# Altium project fish on its own.PrjPcb
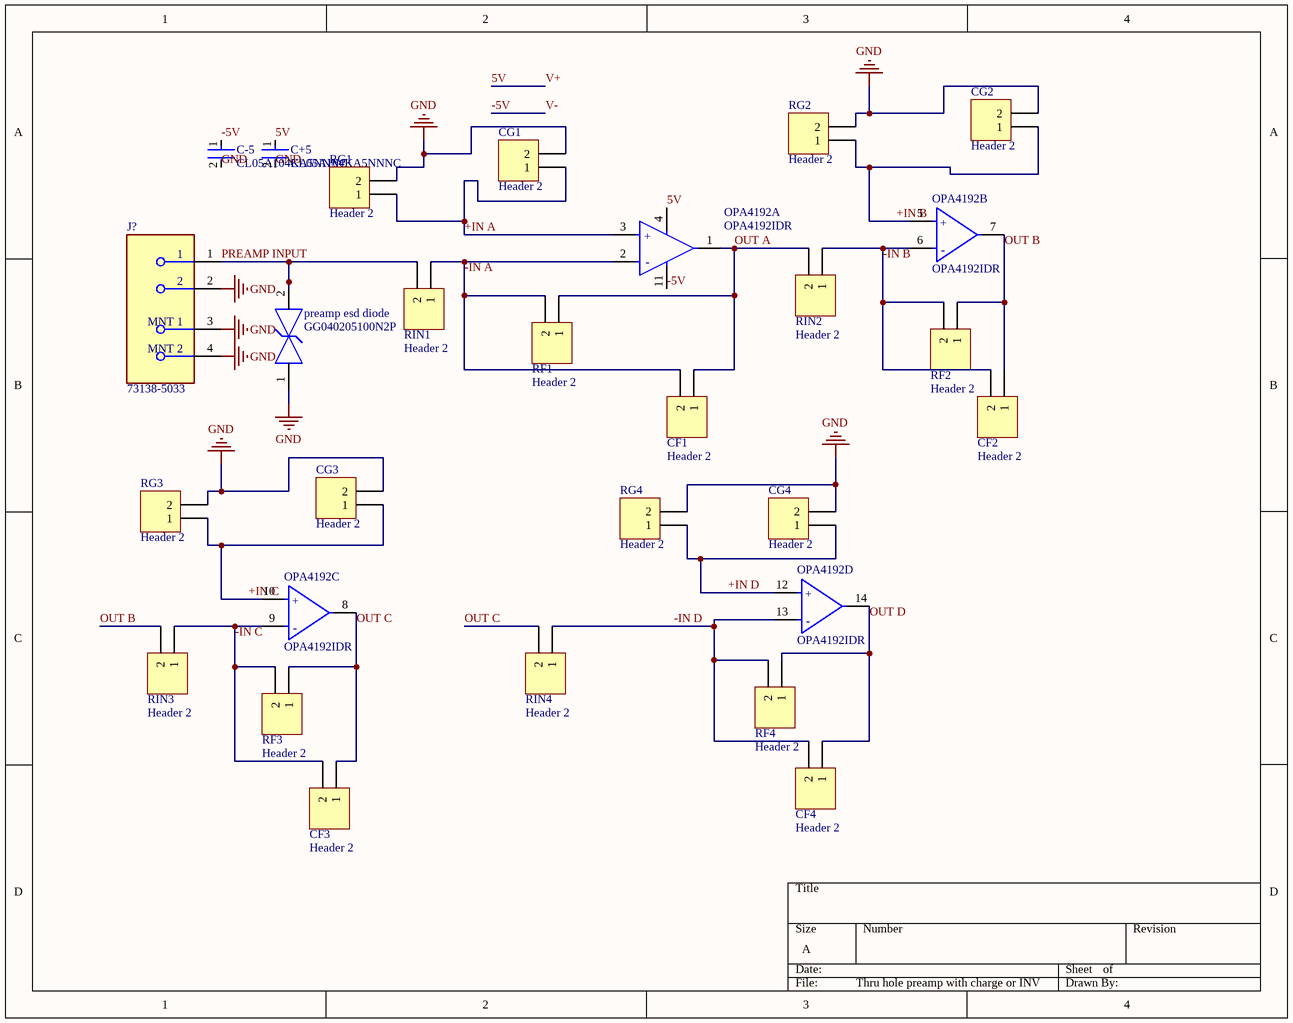
[diagram p0: Thru hole preamp with charge or INV stages with input resistors.SchDoc]
1 sheet, 25 parts. Net scope: global (net labels, ports and power ports of the same name join across sheets).
Board files: fish with thicker fin.PcbDoc, PCB1.PcbDoc

## Sheet Thru hole preamp with charge or INV stages with input resistors.SchDoc
size A; SheetNumber: 2; SheetTotal: 2

### Parts
C+5  CL05A104KA5NNNC  [FP-CL278-IPC_C]
C-5  CL05A104KA5NNNC  [FP-CL278-IPC_C]
CF1  Header 2  [HDR1X2]
CF2  Header 2  [HDR1X2]
CF3  Header 2  [HDR1X2]
CF4  Header 2  [HDR1X2]
CG1  Header 2  [HDR1X2]
CG2  Header 2  [HDR1X2]
CG3  Header 2  [HDR1X2]
CG4  Header 2  [HDR1X2]
J?  73138-5033  [FP-73138-5033-MFG]
OPA4192  OPA4192IDR  [FP-D0014A-IPC_C]  (parts A,B,C,D of 4)
preamp_esd_diode  GG040205100N2P  [FP-GG0402-MFG]
RF1  Header 2  [HDR1X2]
RF2  Header 2  [HDR1X2]
RF3  Header 2  [HDR1X2]
RF4  Header 2  [HDR1X2]
RG1  Header 2  [HDR1X2]
RG2  Header 2  [HDR1X2]
RG3  Header 2  [HDR1X2]
RG4  Header 2  [HDR1X2]
RIN1  Header 2  [HDR1X2]
RIN2  Header 2  [HDR1X2]
RIN3  Header 2  [HDR1X2]
RIN4  Header 2  [HDR1X2]

### Nets
GND: C+5.2 C-5.2 CG1.2 CG2.2 CG3.2 CG4.2 J?.2 J?.3(MNT_1) J?.4(MNT_2) preamp_esd_diode.1(IO_1) RG1.2 RG2.2 RG3.2 RG4.2
5V: C+5.1 OPA4192.4(V+)  [also labelled V+]
+IN A: CG1.1 OPA4192.3(+IN_A) RG1.1
+IN B: CG2.1 OPA4192.5(+IN_B) RG2.1
+IN C: CG3.1 OPA4192.10(+IN_C) RG3.1
+IN D: CG4.1 OPA4192.12(+IN_D) RG4.1
-5V: C-5.1 OPA4192.11(V-)  [also labelled V-]
-IN A: CF1.2 OPA4192.2(-IN_A) RF1.2 RIN1.1
-IN B: CF2.2 OPA4192.6(-IN_B) RF2.2 RIN2.1
-IN C: CF3.2 OPA4192.9(-IN_C) RF3.2 RIN3.1
-IN D: CF4.2 OPA4192.13(-IN_D) RF4.2 RIN4.1
OUT A: CF1.1 OPA4192.1(OUT_A) RF1.1 RIN2.2
OUT B: CF2.1 OPA4192.7(OUT_B) RF2.1 RIN3.2
OUT C: CF3.1 OPA4192.8(OUT_C) RF3.1 RIN4.2
OUT D: CF4.1 OPA4192.14(OUT_D) RF4.1
PREAMP INPUT: J?.1 preamp_esd_diode.2(IO_2) RIN1.2

### Notes on the sheet
- (in symbol CMP-04895-000275-1, part A) +; -
- (in symbol CMP-04895-000275-1, part B) +; -
- (in symbol CMP-04895-000275-1, part C) +; -
- (in symbol CMP-04895-000275-1, part D) +; -

### Library data of the parts
C+5 C-5 = CMP-13271-000728-1: Cap Ceramic 100nF 25V X5R ±10% SMD 0402 +85°C Paper T/R; Package Quantity: 1; Height: 0.5mm; Case Code (Metric): 1005; Thickness: 0.022inch; Mount: Surface Mount; Lead Free: Lead Free; Case Code (Imperial): 0402; Packaging: Tape and Reel; Depth: 0.5mm; Voltage: 25V; Min Operating Temperature: -55°C; Voltage Rating: 25V; Dielectric: X5R; Case/Package: 0402; Tolerance: 10%; Width: 0.02inch; Max Operating Temperature: 85°C; Capacitance: 100nF; Length: 1mm; Radiation Hardening: No; Voltage Rating (DC): 25V
CF1-CF4 CG1-CG4 RF1-RF4 RG1-RG4 RIN1-RIN4 = Header 2: Header, 2-Pin; LatestRevisionDate: 17-Jul-2002; LatestRevisionNote: Re-released for DXP Platform.; Publisher: Altium Limited
J? = CMP-00257-00776601-1: 73138-5033 RF BNC Connector, Female, Panel Mount, Board And Panel Mount, Solder Terminal, Receptacle; Manufacturer Lifecycle Status: ACTIVE; NexarPartId: 776601; Connector Type: BNC, Receptacle, Socket; Body Material: Zinc; Body Plating: Nickel; Dielectric Material: PP; Impedance: 50Ω; Frequency: 2GHz; Packaging: Bulk; Insulation Material: Polypropylene; Housing Color: Silver; Termination: Solder; Length: 35.43mm; Country of Origin: US; Gender: Female; Fastening Type: Bayonet; RoHS: Compliant; Radiation Hardening: No; Contact Plating: Gold; Orientation: Right Angle; Contact Material: Bronze; Lead Free: Lead Free; Mount: Through Hole; Lifecycle Status: Production; Depth: 14.66mm
OPA4192 = CMP-04895-000275-1: IC OPAMP GP 4 CIRCUIT 14SOIC; Input Offset Voltage (Vos): 5uV; Max Supply Voltage: 36V; Operating Supply Current: 1mA; Number of Circuits: 1; Input Bias Current: 5pA; Max Dual Supply Voltage: 18V; Gain Bandwidth Product: 10MHz; Output Current per Channel: 65mA; Min Supply Voltage: 4.5V; Common Mode Rejection Ratio: 100dB; Voltage Gain: 140dB; Number of Channels: 4; Slew Rate: 20V/µs; Min Dual Supply Voltage: 2.25V; Max Operating Temperature: 125°C; Packaging: Tape and Reel; Lead Free: Lead Free; RoHS Compliant: Yes; Number of Pins: 14; Case/Package: SOIC; Mount: Surface Mount; Min Operating Temperature: -40°C
preamp_esd_diode = CMP-04587-000001-1: TVS DIODE 5V 12V 0402; Manufacturer: AVX Corporation; Number Of Channels: 1; Peak Pulse Current: 16A; Capacitance: 10pF; Direction: Bidirectional; Value: 10pF; Breakdown Voltage: 5.5V; Peak Pulse Power: 96W; Automotive: No; ComponentLink2URL: http://datasheets.avx.com/AVX-GiGuard.pdf; Manufacturer Part Number: GG040205100N2P; Lead Free: Yes; Device Class L2: TVS Diodes; Temperature: -55°C to +125°C; Category: Diode; Reverse Standoff Voltage: 5V; Octopart: https://octopart.com/gg040205100n2p-avx-81066081; Clamping Voltage: 12V; Ipc Land Pattern Name: DIOC10060X50; Digikey Description: TVS DIODE 5V 12V 0402; Device Class L3: unset; ComponentLink2Description: Datasheet; Temperature Range Low: -55°C; Temperature Range High: +125°C; Device Class L1: Circuit Protection; Height: 0.55mm; Package: GG0402; RoHS: TRUE